# Altium schematic sheet 01 COVER PAGE.SchDoc
size 420 x 297 mm
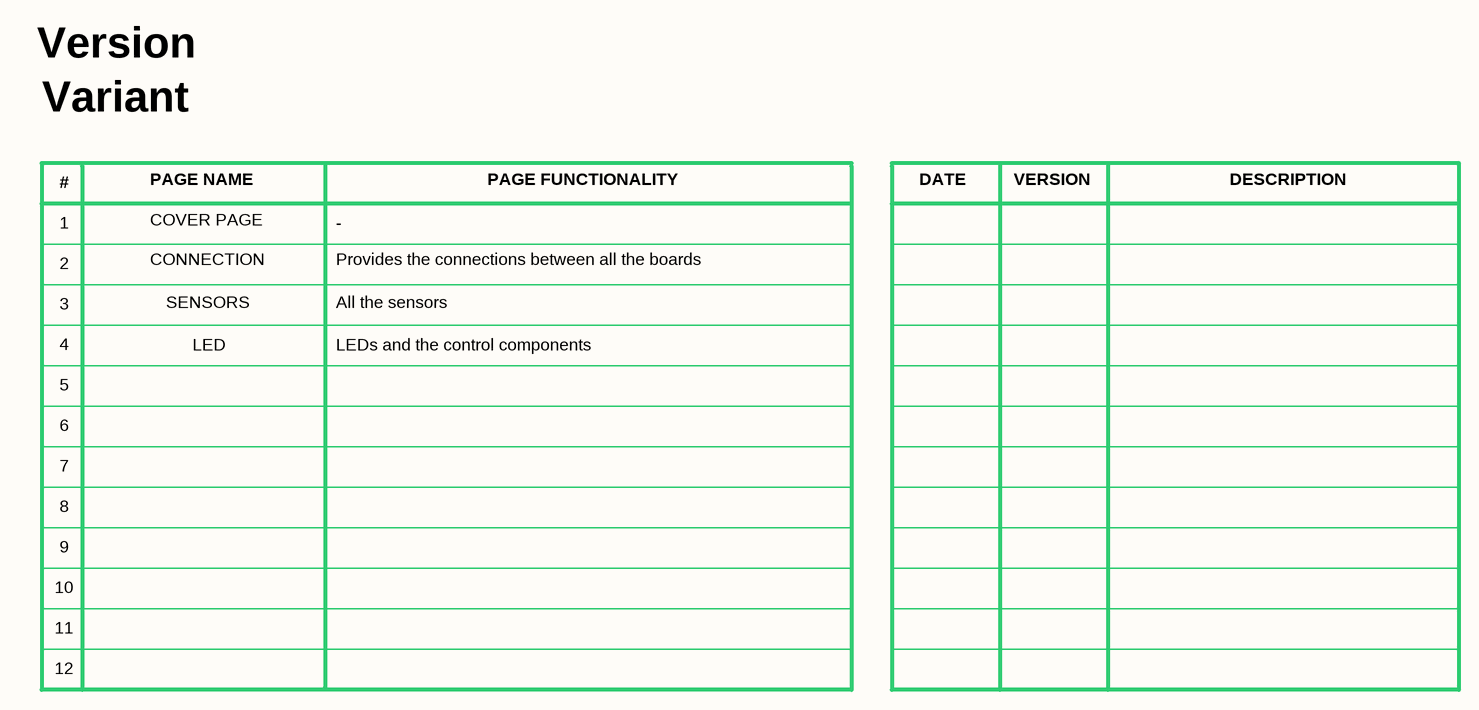
[diagram p0: 01 COVER PAGE.SchDoc]

## Notes on the sheet
- Version
- Variant
- #
- PAGE NAME
- PAGE FUNCTIONALITY
- DATE
- VERSION
- DESCRIPTION
- 1
- 2
- CONNECTION
- COVER PAGE
- Provides the connections between all the boards
- -
- 3
- 4
- SENSORS
- All the sensors
- 5
- LED
- LEDs and the control components
- 6
- 7
- 8
- 9
- 10
- 11
- 12
- Title
- Project
- Size
- Date
- Revision
- A3